# EAGLE design battery (EAGLE 7.7.0)
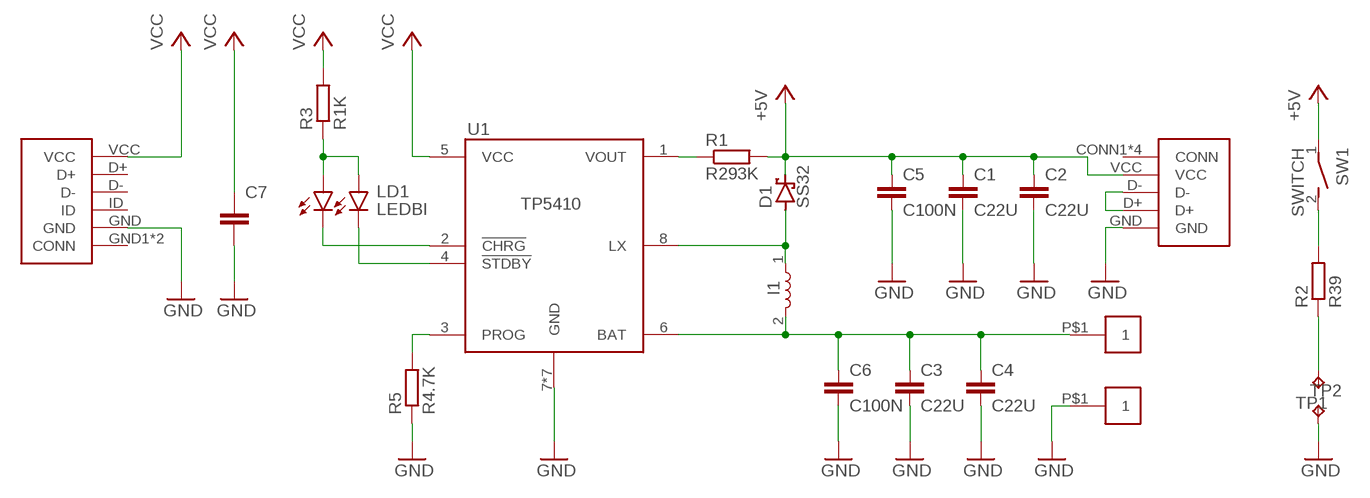
[diagram p0: schematic, sheet 1]

## Parts
BAT+  PIN  [PIN]
C1  C22U  [CAPC2214X120]
C2  C22U  [CAPC2214X120]
C3  C22U  [CAPC2214X120]
C4  C22U  [CAPC2214X120]
C5  C100N  [CAPC1508X45]
C6  C100N  [CAPC1508X45]
C7  C-EUC0603K  [C0603K]
D1  SS32  [DIOM6859X265]
I1  IND47M  [DR73]
LD1  LEDBI  [LEDBI0603]
R1  R293K  [RESC1508X30]
R2  R39  R0.3  [RESC3116X40]
R3  R1K  [RESC1508X30]
R5  R4.7K  R680  [RESC1508X30]
SW1  SWITCH  [BUTTON]
TP1  TPB1,27  [B1,27]
TP2  TPB1,27  [B1,27]
U1  TP5410  [SOIC127P600X175-8]
U$1  USB20  [USB20]
U$3  MICRO-USB  [MICRO-USB]
U$5  PIN  [PIN]

## Nets
+5V: C1.1 C2.1 C5.1 D1.1(C) R1.2 SW1.1(P) U$1.VCC
CHRG: LD1.K1 U1.2(!CHRG)
GND: C1.2 C2.2 C3.2 C4.2 C5.2 C6.2 C7.2 R5.1 TP2.TP U1.7(GND) U1.GND1(GND) U1.GND2(GND) U1.GND3(GND) U1.GND4(GND) U1.GND5(GND) U1.GND6(GND) U$1.GND U$3.GND U$5.P$1
LEDCOMM: LD1.A1 LD1.A2 R3.1
LX: D1.2(A) I1.1 U1.8(LX)
N$1: U$1.D+ U$1.D-
N$2: R2.2 SW1.2(S)
N$3: R2.1 TP1.TP
PROG: R5.2 U1.3(PROG)
STDBY: LD1.K2 U1.4(!STDBY)
VBAT: BAT+.P$1 C3.1 C4.1 C6.1 I1.2 U1.6(BAT)
VCC: C7.1 R3.2 U1.5(VCC) U$3.VCC
VOUT: R1.1 U1.1(VOUT)
Unconnected: U$1.CONN1(CONN) U$1.CONN2(CONN) U$1.CONN3(CONN) U$1.CONN4(CONN) U$3.D+ U$3.D- U$3.GND1(CONN) U$3.GND2(CONN) U$3.ID

## Library data of the parts
BAT+ U$5 = alim:PIN
C1-C4 = alim:C22U
C5 C6 = alim:C100N
C7 = rcl:C-EU: CAPACITOR, European symbol
D1 = alim:SS32
I1 = alim:IND47M
LD1 = alim:LEDBI
R1 = alim:R293K
R2 = alim:R0.3
R3 = alim:R1K
R5 = alim:R680
SW1 = alim:SWITCH
TP1 TP2 = testpad:TP: Test pad
U1 = alim:TP5410
U$1 = alim:USB20
U$3 = alim:MICRO-USB

## Board
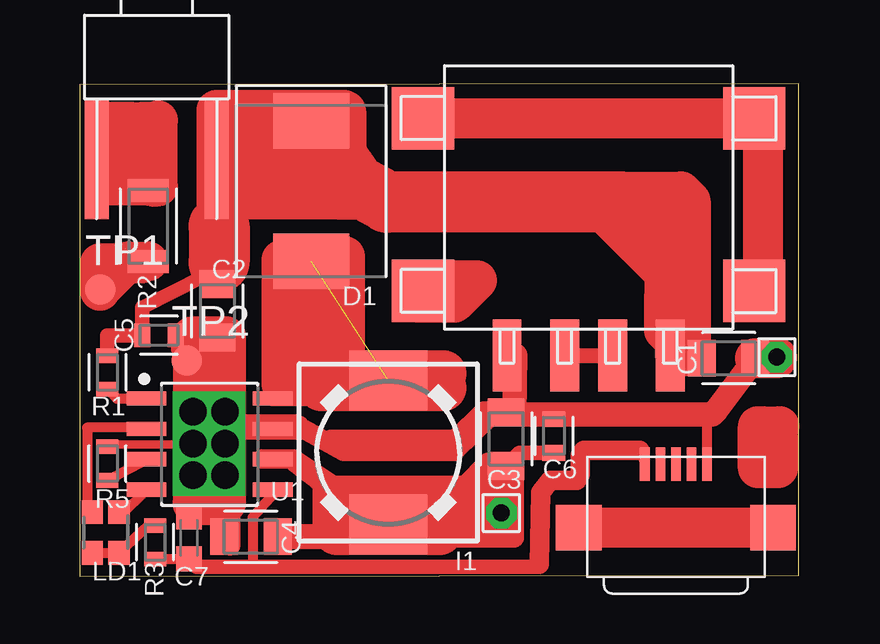
[diagram p1: board, top side]

Size 29.95 x 20.55 mm. Coordinates in mm from the lower left corner, seen from the top.
Outline: 0,0 29.95,0.05 29.95,20.55 0,20.5 0,0
Copper layers (1*16): Top 0.035mm / dielectric 1.5mm / Bottom 0.035mm
Design rules "default *": minimum track width 0.2mm, minimum drill 0.35mm, track to track 0.2mm, track to pad 0.2mm, pad to pad 0.2mm, via to via 0.2mm, smd to smd 0mil, copper to edge 0mil, drill to drill 6mil, minimum pad ring 10mil, minimum via ring 8mil, stop-mask expansion 4mil, vias tented up to drill 0mil, thermal gap 10mil

### Footprints (pad centres in the part's own frame; a part is rotated, then mirrored left to right if it is on the bottom)
PIN = drill 0.7 pad 1.27 octagon: P$1 0,0
CAPC2214X120 = smd 1.163 x 1.512: 1 -1.127,0; 2 1.102,0
CAPC1508X45 = smd 0.662 x 0.962: 1 -0.7,0; 2 0.7,0
C0603K = smd 1.05 x 1.08: 1 -0.875,0; 2 0.875,0
DIOM6859X265 = smd 2.301 x 3.182: 1 -2.93,0; 2 2.93,0
DR73 = smd 2.5 x 3.25: 1 -3,0; 2 3,0
LEDBI0603 = smd 0.991 x 0.889: A1 -0.825,-0.533; A2 -0.825,0.584; K1 0.875,0.584; K2 0.875,-0.533
RESC1508X30 = smd 0.612 x 0.912: 1 -0.7,0; 2 0.7,0
RESC3116X40 = smd 0.962 x 1.712: 1 -1.475,0; 2 1.475,0
BUTTON = smd 5 x 1: 1 2.5,2.5; 2 2.5,-2.5
B1,27 = smd 1.27 x 1.27: TP 0,0
SOIC127P600X175-8 = smd 1.651 x 0.602: 1 -2.626,1.905; 2 -2.626,0.635; 3 -2.626,-0.635; 4 -2.626,-1.905; 5 2.626,-1.905; 6 2.626,-0.635; 7 2.626,0.635; 8 2.626,1.905 | drill 1.143 pad 1.321 square: GND1 -0.686,1.346; GND2 0.635,1.346; GND3 -0.686,0.025; GND4 0.635,0.025; GND5 -0.686,-1.295; GND6 0.635,-1.295
USB20 = smd 2.6 x 2.6: CONN1 -3.9,6.9; CONN2 3.3,6.9; CONN3 -3.9,-6.9; CONN4 3.3,-6.9 | smd 3 x 1.2: D+ -6.6,1; D- -6.6,-1; GND -6.6,3.4; VCC -6.6,-3.4
MICRO-USB = smd 0.4 x 1.4: D+ 1.3,0; D- 0.65,0; GND 2.6,0; ID 1.95,0; VCC 0,0 | smd 1.9 x 1.9: GND1 -2.75,-2.65; GND2 5.35,-2.65

### Placement (x,y rotation side)
BAT+  17.56,2.64 90 top
C1  27.04,9.09 0 top
C2  5.73,11.06 270 top
C3  17.76,5.72 90 top
C4  7.12,1.65 180 top
C5  3.3,10.05 0 top
C6  19.75,5.85 90 top
C7  4.55,1.6 90 top
D1  9.64,16.06 270 top
I1  12.85,5.16 270 top
LD1  1.1,1.8 90 top
R1  1.15,8.5 90 top
R2  2.85,14.6 90 top
R3  3.14,1.42 270 top
R5  1.15,4.7 270 top
SW1  3.2,19.9 270 top
TP1  0.85,11.95 0 top
TP2  4.45,9 0 top
U1  5.41,5.51 0 top
U$1  21.2,15.8 90 top
U$3  23.54,4.68 0 top
U$5  29.04,9.14 90 top

### Tracks (layer width: path | path; a pad name or v marks a point on that pad's centre or on a via)
+5V
  Top 0.406: 5.15,12.5 5.52,12.5 C2.1
  Top 0.61: R1.2 1.15,10.05 C5.1 2.6,11.2 5.15,12.5 | 5.8,13.1 5.93,12.97 C2.1 | 5.8,14.6 | 5.8,14.6 5.79,14.83 SW1.1
  Top 1.016: 5.7,15.6 SW1.1 | U$1.VCC 24.95,9.09 C1.1
  Top 1.27: U$1.VCC 24.6,15.6 22.2,15.6
  Top 1.676: D1.1 5.79,18.99 5.79,14.83
  Top 2.54: 22.7,15.6 22.2,15.6 12.8,15.6 11.53,16.3 D1.1 | 5.8,14.6 5.8,13.1
CHRG
  Top 0.254: U1.2 2.78,6.2
  Top 0.305: 0.3,3 0.62,3 LD1.K1
  Top 0.406: 2.78,6.2 0.3,6.2 0.3,3
GND
  Top 0.2: 1.03,5.39 1.05,5.49
  Top 0.203: 20,6.75 | C7.2 4.87,2.65 4.87,2.8 | C6.2 19.55,6.75 19.45,6.75
  Top 0.305: R5.1 1.05,5.49 | 4.72,6.8 U1.GND1
  Top 0.356: 1.05,5.49 4.72,5.49
  Top 0.406: 8.19,6.15 U1.7 | U$3.GND 26.14,6.75 | C5.2 4,9.45 TP2.TP | C2.2 TP2.TP | TP2.TP U1.GND1 | 4.72,5.49 U1.GND5
  Top 0.61: 8.19,6.15 9.3,6.15 | U1.7 6.04,6.14 | 6.04,6.14 U1.GND4 | U1.GND1 U1.GND2 6.04,6.14 | U1.GND4 4.72,5.49 U1.GND3 | U1.GND6 U1.GND4
  Top 0.813: C3.2 17.28,6.83 15.6,5.2 11,5.2 9.3,6.15
  Top 1.016: 18.1,6.75 19.45,6.75 20,6.75 26.14,6.75 26.35,6.75 26.51,6.91 C1.2 | 18.1,6.75 18.15,9.2 U$1.GND | C3.2 18.32,6.83 18.1,6.75 | 5.93,6.97 U1.GND2 | U1.GND5 4.72,2.8 4.87,2.65 6.02,2.65 C4.2
  Top 1.676: U$5.P$1 29.04,9.09 C1.2
LEDCOMM
  Top 0.305: 2.88,2.12 R3.1
  Top 0.406: 2.88,2.12 LD1.A1 LD1.A2
LX  (1 unrouted)
  Top 0.625: U1.8 12.11,7.42 I1.1
N$1
  Top 0.625: U$1.D+ U$1.D-
N$2
  Top 0.203: 0.85,15.2 SW1.2
  Top 0.61: 0.85,16.07 0.85,15.2
  Top 0.625: R2.2 0.85,16.07
N$3
  Top 1.676: TP1.TP 2.02,13.12 R2.1
N$4
  Top 0.875: 9.9,7.75 9.9,12.25
N$6
  Top 0.875: 9.4,12.15 9.4,7.85
N$7
  Top 1.676: 7.7,17.15 7.7,19.45 | 7.7,19.45 8.4,19.45 | 8.4,19.45 11,19.45 | 5.7,15.45 5.7,19.45 7.7,19.45 | 8.4,19.45 8.4,18.1 6.7,18.1
N$8
  Top 0.875: 6.25,4.85 6.25,1.3
N$9
  Top 1.676: 5.8,10 4.7,10 4.7,3.05 6.1,3.05 6.1,10
N$10
  Top 1.676: 11.1,19.4 11.1,17.7
N$11
  Top 1.676: 9.45,13.2 8.4,13.2 8.4,8 11.05,8 11.05,13.35
N$12
  Top 0.813: 17.45,4.6 17.45,2.25 arc-90 17.3,2.1 17.3,4.5 arc-90 17.55,4.75
N$13
  Top 1.93: 10.3,8.45 15.15,8.45
N$14
  Top 1.676: 17.65,2.45 12.35,2.45
N$15
  Top 1.93: 13.1,2.4 10.7,2.45
N$16
  Top 1.93: 10.05,7.85 15.15,7.85
N$17
  Top 1.93: 15,1.85 10.7,1.85
N$19
  Top 1.676: 2.9,16.3 1.05,16.3 1.05,18.95
N$20
  Top 1.676: 14.55,19.1 28.45,19.1 28.45,11.85
N$21
  Top 1.676: 20.7,2.05 28.95,2.05 28.95,2
N$23
  Top 1.676: 6.35,17 6.35,16.95 10.85,16.95 10.85,15.7 | 10.85,15.7 6.55,15.7 | 10.85,15.7 12.4,15.7
N$26
  Top 1.676: 29.1,6.15 29.1,6.1 28.45,6.1 28.45,6.25 29.15,6.25
N$27
  Top 0.813: 17.9,4.55 18,4.55 18,1.6 18.1,1.6 18.1,4.6
N$28
  Top 0.813: 8.95,4.75 10.45,3.6 16.95,3.6 17,3.65 17,4.75 16.05,3.8 10.4,3.8
N$29
  Top 0.813: 10.45,5.7 15.65,5.7 16.85,6.9 17.95,6.9
N$30
  Top 0.813: 9.15,6.3 7.45,6.3 7.45,6.1 9.25,6.1
N$31
  Top 0.813: 6.25,6.4 6.25,6.35 9,6.35 9,6.1 6.6,6.1
N$32
  Top 0.813: 7.6,4.9 8.9,4.9 10.45,3.85
N$33
  Top 1.676: 2.6,13.05 0.85,13.05 0.85,11.9
N$34
  Top 1.676: 14.25,11.95 14.65,12.35 16.55,12.35 15.6,11.4 14.1,11.4
N$35
  Top 1.676: 21.15,15.95 21.25,16.05 25.05,16.05 25.45,15.65 25.45,9.15 24.35,10.25 24.35,11.65 24.35,12.65 | 24.35,12.65 24.35,15.45 24.05,15.15 21.85,15.15 24.35,12.65
N$36
  Top 1.676: 28.7,6.15 29.1,5.75 29.1,4.5 28.25,4.5 28.25,6.25
N$37
  Top 1.676: 1.15,18.95 2.15,18.95 2.15,16.45 2.6,16.45 2.6,18.95 3,18.95 3,16.25 3.25,16.25 3.25,19
PROG
  Top 0.406: R5.2 U1.3
STDBY
  Top 0.305: LD1.K2 1.75,2.58
  Top 0.406: 1.75,2.58 U1.4
VBAT
  Top 0.61: U1.6 9.03,4.88 10,3.75 10,1.65 | C3.1 18.31,5.15 C6.1
  Top 0.813: 17.81,2.64 17.81,4.6 C3.1 | 17.8,1.7 17.81,1.7 17.81,2.64 | 17.81,2.64 BAT+.P$1
  Top 1.016: C4.1 8.36,1.54 | C4.1 12.69,1.75 I1.2 | I1.2 12.89,2.01 12.95,1.95 12.7,1.95 | C4.1 8.3,1.65 10,1.65 13,1.65 | BAT+.P$1 17.8,2.59 | 17.8,1.7 13.17,1.69 I1.2 | 17.8,4.56 C3.1
VCC
  Top 0.04: 19.15,0.5 19.1,0.4 18.6,0.4
  Top 0.305: U1.5 8.11,3.46 | C7.1 4.88,0.4
  Top 0.406: 23.34,5.25 U$3.VCC | R3.2 C7.1 | 8.11,3.46 7.2,2.45 7.2,0.4
  Top 0.61: 4.88,0.4 7.2,0.4 18.6,0.4 19.05,0.4 19.15,0.5
  Top 0.813: 19.15,0.5 19.2,3.5 19.6,4 20.7,4 20.85,4.25 20.85,5.05 21,5.25 23.34,5.25
VOUT
  Top 0.406: R1.1 1.53,7.42 U1.1